# EAGLE schematic CarteCapteur (EAGLE 5.00)
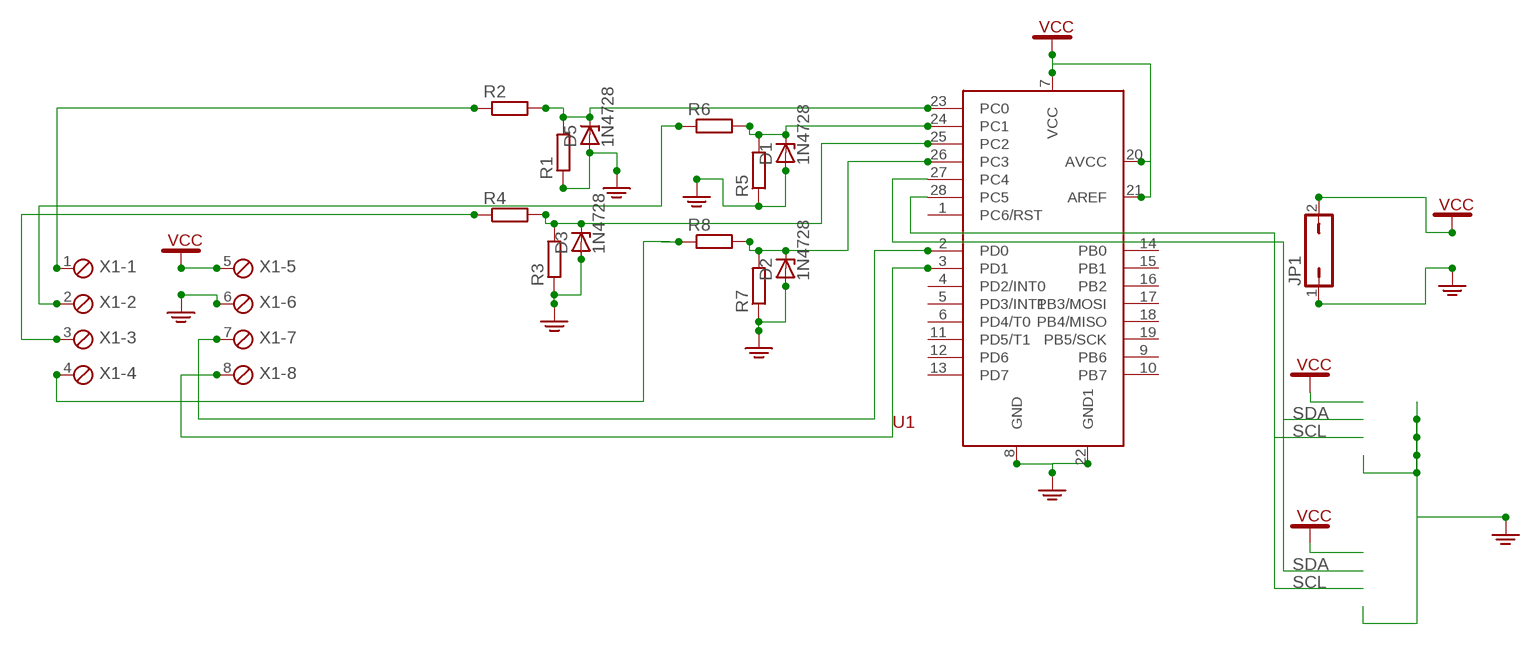
[diagram p0: schematic, sheet 1]

## Parts
D1  1N4728  [DO41Z10]
D2  1N4728  [DO41Z10]
D3  1N4728  [DO41Z10]
D5  1N4728  [DO41Z10]
JP1  JP1Q  [JP1]
R1  R-EU_0207/10  [0207/10]
R2  R-EU_0207/10  [0207/10]
R3  R-EU_0207/10  [0207/10]
R4  R-EU_0207/10  [0207/10]
R5  R-EU_0207/10  [0207/10]
R6  R-EU_0207/10  [0207/10]
R7  R-EU_0207/10  [0207/10]
R8  R-EU_0207/10  [0207/10]
U1  ATMEGA88  [AT28DIP]
X1  MPT8  [8POL254]

## Nets
GND: D1.A D2.A D3.A D5.A JP1.1 R1.1 R3.1 R5.1 R7.1 U1.8(GND) U1.22(GND1) X1.6
N$1: D5.C R1.2 R2.2 U1.23(PC0)
N$2: D1.C R5.2 R6.2 U1.24(PC1)
N$3: D3.C R3.2 R4.2 U1.25(PC2)
N$4: D2.C R7.2 R8.2 U1.26(PC3)
N$5: R2.1 X1.1
N$6: R6.1 X1.2
N$7: R4.1 X1.3
N$8: R8.1 X1.4
RXD: U1.2(PD0) X1.7
SCL: U1.28(PC5)
SDA: U1.27(PC4)
TXD: U1.3(PD1) X1.8
VCC: JP1.2 U1.7(VCC) U1.20(AVCC) U1.21(AREF) X1.5
Unconnected: U1.1(PC6/RST) U1.4(PD2/INT0) U1.5(PD3/INT1) U1.6(PD4/T0) U1.9(PB6) U1.10(PB7) U1.11(PD5/T1) U1.12(PD6) U1.13(PD7) U1.14(PB0) U1.15(PB1) U1.16(PB2) U1.17(PB3/MOSI) U1.18(PB4/MISO) U1.19(PB5/SCK)

## Library data of the parts
D1-D3 D5 = diode:1N4728: Z DIODE 3.3 V, 1W, 5 percent
JP1 = jumper:JP1Q: JUMPER
R1-R8 = rcl:R-EU_: RESISTOR, European symbol
U1 = ATMELµC:ATMEGA88
X1 = con-phoenix-254:MPT8: PHOENIX CONNECTOR